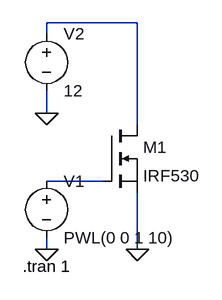
[diagram p0: schematic MOSFET.asc]
MOSFET.asc, the LTspice schematic file:
Version 4
SHEET 1 880 680
WIRE 80 -80 -48 -80
WIRE -48 -64 -48 -80
WIRE -48 48 -48 16
WIRE 80 64 80 -80
WIRE 32 144 -48 144
WIRE -48 240 -48 224
WIRE 80 240 80 160
FLAG 80 240 0
FLAG -48 240 0
FLAG -48 48 0
SYMBOL nmos 32 64 R0
SYMATTR InstName M1
SYMATTR Value IRF530
SYMBOL voltage -48 128 R0
WINDOW 123 0 0 Left 2
WINDOW 39 0 0 Left 2
SYMATTR InstName V1
SYMATTR Value PWL(0 0 1 10)
SYMBOL voltage -48 -80 R0
WINDOW 123 0 0 Left 2
WINDOW 39 0 0 Left 2
SYMATTR InstName V2
SYMATTR Value 12
TEXT -82 264 Left 2 !.tran 1

The netlist it stands for:
* MOSFET.asc
M1 N001 N002 0 0 IRF530
V1 N002 0 PWL(0 0 1 10)
V2 N001 0 12
.model NMOS NMOS
.model PMOS PMOS
.lib standard.mos
.tran 1
.backanno
.end